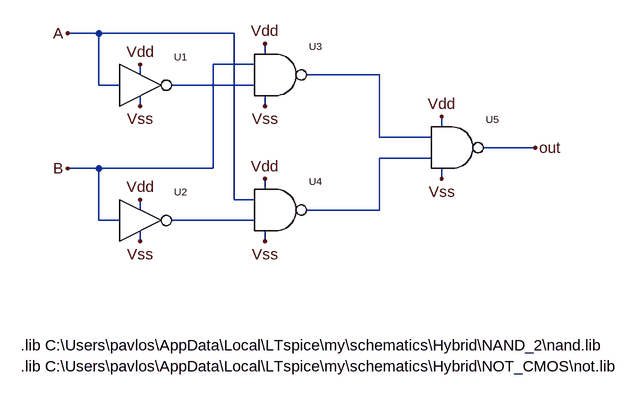
[diagram p0: schematic xor.asc]
xor.asc, the LTspice schematic file:
Version 4
SHEET 1 880 680
WIRE -544 -352 -592 -352
WIRE -336 -352 -544 -352
WIRE -288 -320 -288 -336
WIRE -304 -304 -368 -304
WIRE -480 -288 -480 -304
WIRE -112 -288 -224 -288
WIRE -544 -272 -544 -352
WIRE -512 -272 -544 -272
WIRE -304 -272 -432 -272
WIRE -480 -240 -480 -256
WIRE -288 -240 -288 -256
WIRE -16 -208 -16 -224
WIRE -112 -192 -112 -288
WIRE -32 -192 -112 -192
WIRE 128 -176 48 -176
WIRE -32 -160 -112 -160
WIRE -544 -144 -592 -144
WIRE -368 -144 -368 -304
WIRE -368 -144 -544 -144
WIRE -16 -128 -16 -144
WIRE -288 -112 -288 -128
WIRE -336 -96 -336 -352
WIRE -304 -96 -336 -96
WIRE -480 -80 -480 -96
WIRE -112 -80 -112 -160
WIRE -112 -80 -224 -80
WIRE -544 -64 -544 -144
WIRE -512 -64 -544 -64
WIRE -304 -64 -432 -64
WIRE -480 -32 -480 -48
WIRE -288 -32 -288 -48
FLAG 128 -176 out
FLAG -592 -144 B
FLAG -592 -352 A
FLAG -480 -96 Vdd
FLAG -480 -304 Vdd
FLAG -480 -32 Vss
FLAG -480 -240 Vss
FLAG -16 -224 Vdd
FLAG -16 -128 Vss
FLAG -288 -128 Vdd
FLAG -288 -32 Vss
FLAG -288 -336 Vdd
FLAG -288 -240 Vss
SYMBOL not -512 -240 R0
SYMATTR InstName U1
SYMBOL not -512 -32 R0
SYMATTR InstName U2
SYMBOL nand -304 -256 R0
SYMATTR InstName U3
SYMBOL nand -304 -48 R0
SYMATTR InstName U4
SYMBOL nand -32 -144 R0
SYMATTR InstName U5
TEXT -664 128 Left 2 !.lib C:\\Users\\pavlos\\AppData\\Local\\LTspice\\my\\schematics\\Hybrid\\NAND_2\\nand.lib
TEXT -664 160 Left 2 !.lib C:\\Users\\pavlos\\AppData\\Local\\LTspice\\my\\schematics\\Hybrid\\NOT_CMOS\\not.lib

The netlist it stands for:
* xor.asc
XU1 A N002 Vdd Vss not  ; pins A Y Vdd Vss
XU2 B N004 Vdd Vss not  ; pins A Y Vdd Vss
XU3 B N002 N001 Vdd Vss nand  ; pins A B Y Vdd Vss
XU4 A N004 N003 Vdd Vss nand  ; pins A B Y Vdd Vss
XU5 N001 N003 out Vdd Vss nand  ; pins A B Y Vdd Vss
.lib C:\Users\pavlos\AppData\Local\LTspice\my\schematics\Hybrid\NAND_2\nand.lib
.lib C:\Users\pavlos\AppData\Local\LTspice\my\schematics\Hybrid\NOT_CMOS\not.lib
.backanno
.end